# Altium schematic sheet Connector_Battery.SchDoc
size A; SheetNumber: 10; SheetTotal: 15
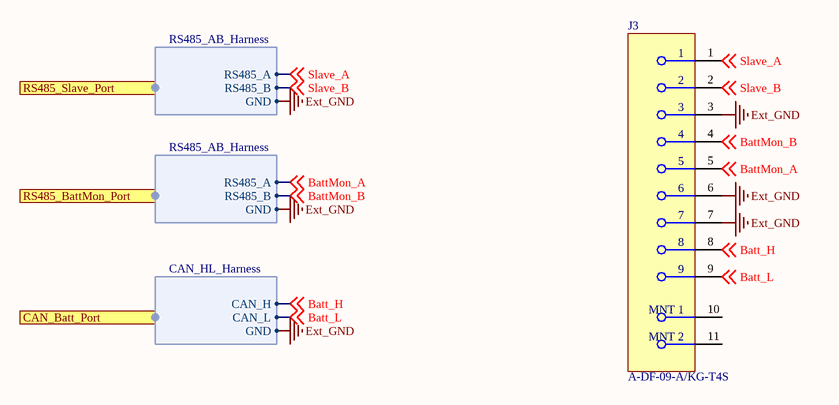
[diagram p0: Connector_Battery.SchDoc]

## Parts
J3  A-DF-09-A/KG-T4S  [FP-A-DF_09_A-KG-T4S-MFG]

## Ports
CAN_Batt_Port (harness CAN_HL_Harness), RS485_BattMon_Port (harness RS485_AB_Harness), RS485_Slave_Port (harness RS485_AB_Harness)

## Harnesses
RS485_AB_Harness: RS485_A, RS485_B, GND
CAN_HL_Harness: CAN_H, CAN_L, GND

## Nets
Ext_GND: J3.3 J3.6 J3.7 ; port RS485_Slave_Port.GND, port RS485_BattMon_Port.GND, port CAN_Batt_Port.GND
Batt_H: J3.8 ; off-sheet Batt_H, port CAN_Batt_Port.CAN_H
Batt_L: J3.9 ; off-sheet Batt_L, port CAN_Batt_Port.CAN_L
BattMon_A: J3.5 ; off-sheet BattMon_A, port RS485_BattMon_Port.RS485_A
BattMon_B: J3.4 ; off-sheet BattMon_B, port RS485_BattMon_Port.RS485_B
Slave_A: J3.1 ; off-sheet Slave_A, port RS485_Slave_Port.RS485_A
Slave_B: J3.2 ; off-sheet Slave_B, port RS485_Slave_Port.RS485_B

Not connected (* = marked no-connect by the designer): J3 10(MNT_1) 11(MNT_2)

## Library data of the parts
J3 = CMP-10493-48660751-2: Conn D-Sub F 9 POS 1.38mm Solder RA Thru-Hole 9 Terminal 1 Port; Manufacturer_P/N: A-DF 09 A/KG-T4S; Min Operating Temperature: -55°C; Mount: Through Hole; Digi-Key_Part_Number: AE10924-ND; JLC P/N: C3140260